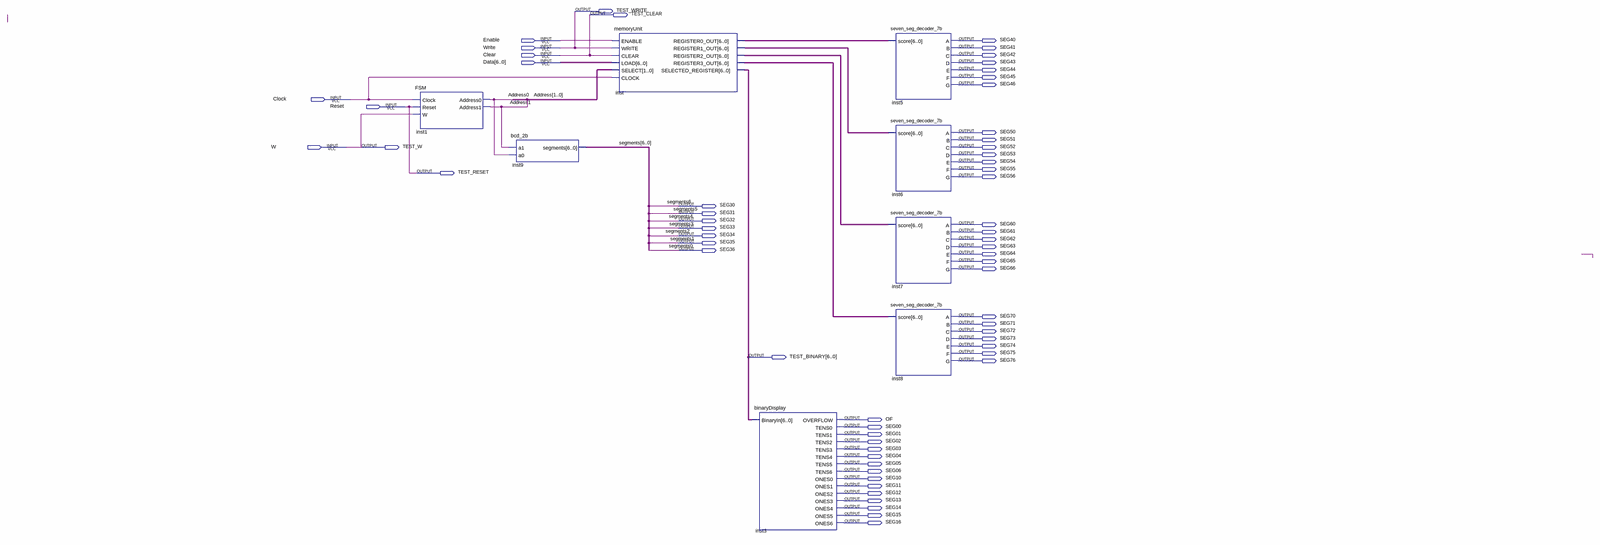
[diagram p0: schematic sheet, whole]
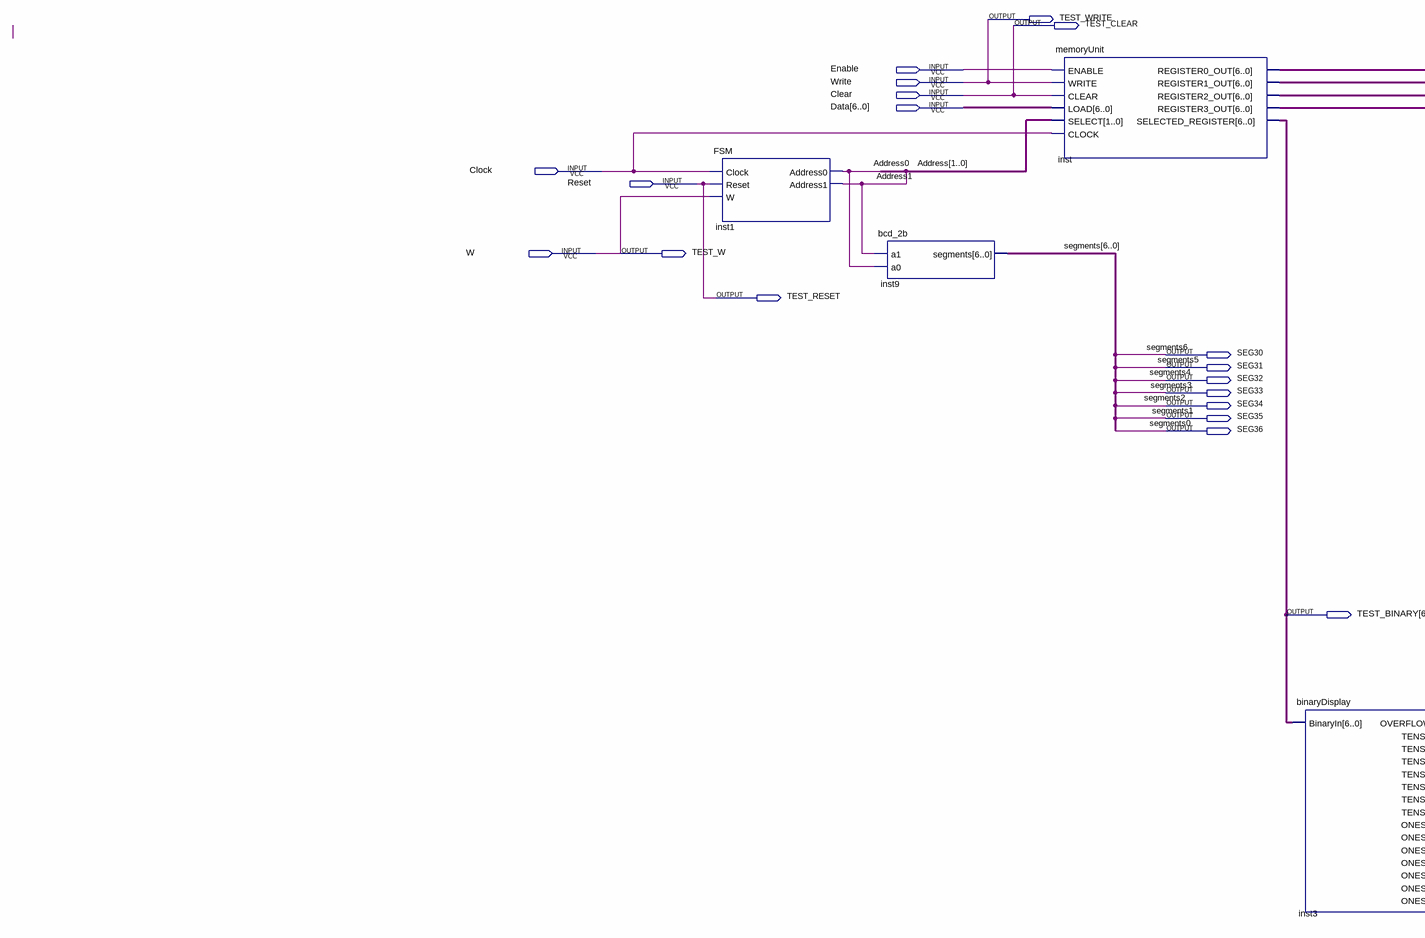
[diagram p1: schematic sheet, left part]
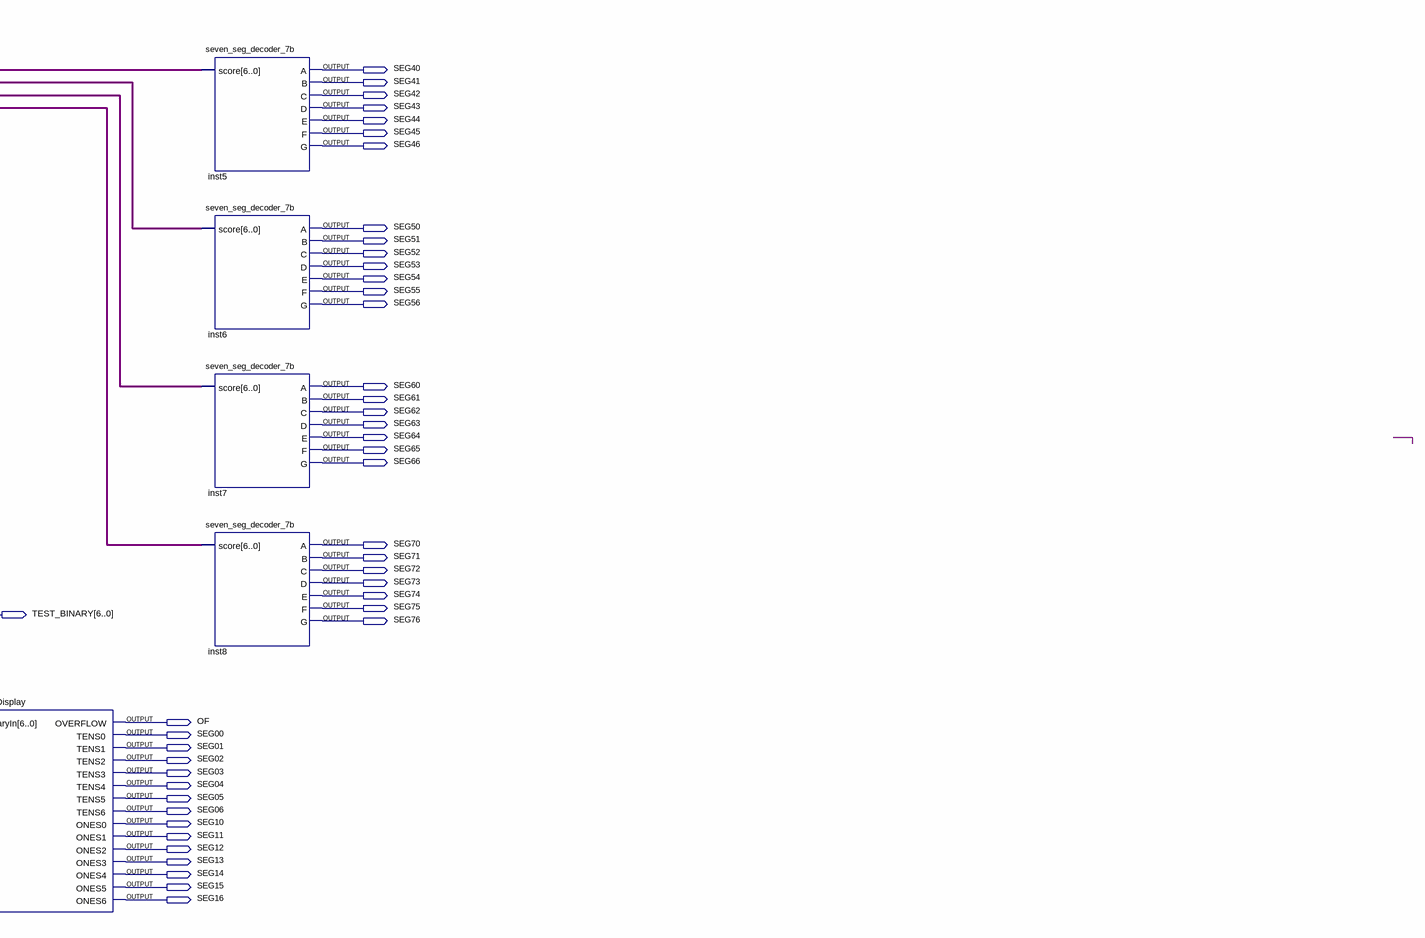
[diagram p2: schematic sheet, right part]
// Quartus schematic main.bdf as structural Verilog: 8 symbols, 62 pins
module main (
  input  Enable,
  input  Write,
  input  Clear,
  input  [6:0] Data,
  input  Clock,
  input  Reset,
  input  W,
  output TEST_WRITE,
  output TEST_CLEAR,
  output SEG40,
  output SEG41,
  output SEG42,
  output SEG43,
  output SEG44,
  output SEG45,
  output SEG46,
  output SEG50,
  output SEG51,
  output TEST_W,
  output SEG52,
  output SEG53,
  output SEG54,
  output SEG55,
  output TEST_RESET,
  output SEG56,
  output SEG30,
  output SEG31,
  output SEG32,
  output SEG60,
  output SEG33,
  output SEG61,
  output SEG34,
  output SEG62,
  output SEG35,
  output SEG63,
  output SEG36,
  output SEG64,
  output SEG65,
  output SEG66,
  output SEG70,
  output SEG71,
  output SEG72,
  output SEG73,
  output SEG74,
  output SEG75,
  output [6:0] TEST_BINARY,
  output SEG76,
  output OF,
  output SEG00,
  output SEG01,
  output SEG02,
  output SEG03,
  output SEG04,
  output SEG05,
  output SEG06,
  output SEG10,
  output SEG11,
  output SEG12,
  output SEG13,
  output SEG14,
  output SEG15,
  output SEG16
);

  wire [1:0] Address;
  wire [6:0] inst_register0_out, inst_register1_out, inst_register2_out, inst_register3_out;

  FSM inst1 (.Clock(Clock), .Reset(Reset), .W(W), .Address0(Address[0]), .Address1(Address[1]));
  bcd_2b inst9 (.a1(Address[1]), .a0(Address[0]), .segments({SEG30, SEG31, SEG32, SEG33, SEG34, SEG35, SEG36}));
  memoryUnit inst (
    .ENABLE(Enable), .WRITE(Write), .CLEAR(Clear), .LOAD(Data), .SELECT(Address), .CLOCK(Clock),
    .REGISTER0_OUT(inst_register0_out), .REGISTER1_OUT(inst_register1_out),
    .REGISTER2_OUT(inst_register2_out), .REGISTER3_OUT(inst_register3_out), .SELECTED_REGISTER(TEST_BINARY));
  binaryDisplay inst3 (
    .BinaryIn(TEST_BINARY), .OVERFLOW(OF), .TENS0(SEG00), .TENS1(SEG01), .TENS2(SEG02), .TENS3(SEG03),
    .TENS4(SEG04), .TENS5(SEG05), .TENS6(SEG06), .ONES0(SEG10), .ONES1(SEG11), .ONES2(SEG12), .ONES3(SEG13),
    .ONES4(SEG14), .ONES5(SEG15), .ONES6(SEG16));
  seven_seg_decoder_7b inst5 (
    .score(inst_register0_out), .A(SEG40), .B(SEG41), .C(SEG42), .D(SEG43), .E(SEG44), .F(SEG45), .G(SEG46));
  seven_seg_decoder_7b inst6 (
    .score(inst_register1_out), .A(SEG50), .B(SEG51), .C(SEG52), .D(SEG53), .E(SEG54), .F(SEG55), .G(SEG56));
  seven_seg_decoder_7b inst7 (
    .score(inst_register2_out), .A(SEG60), .B(SEG61), .C(SEG62), .D(SEG63), .E(SEG64), .F(SEG65), .G(SEG66));
  seven_seg_decoder_7b inst8 (
    .score(inst_register3_out), .A(SEG70), .B(SEG71), .C(SEG72), .D(SEG73), .E(SEG74), .F(SEG75), .G(SEG76));

  assign TEST_CLEAR = Clear;
  assign TEST_RESET = Reset;
  assign TEST_W = W;
  assign TEST_WRITE = Write;

  // Other names for the same wires on the sheet: segments[6:0] = {SEG30, SEG31, SEG32, SEG33, SEG34, SEG35, SEG36};
  //   segments0 = SEG36; segments1 = SEG35; segments2 = SEG34; segments3 = SEG33; segments4 = SEG32;
  //   segments5 = SEG31; segments6 = SEG30
endmodule
